# EAGLE design smarty02 (EAGLE 6.5.0)
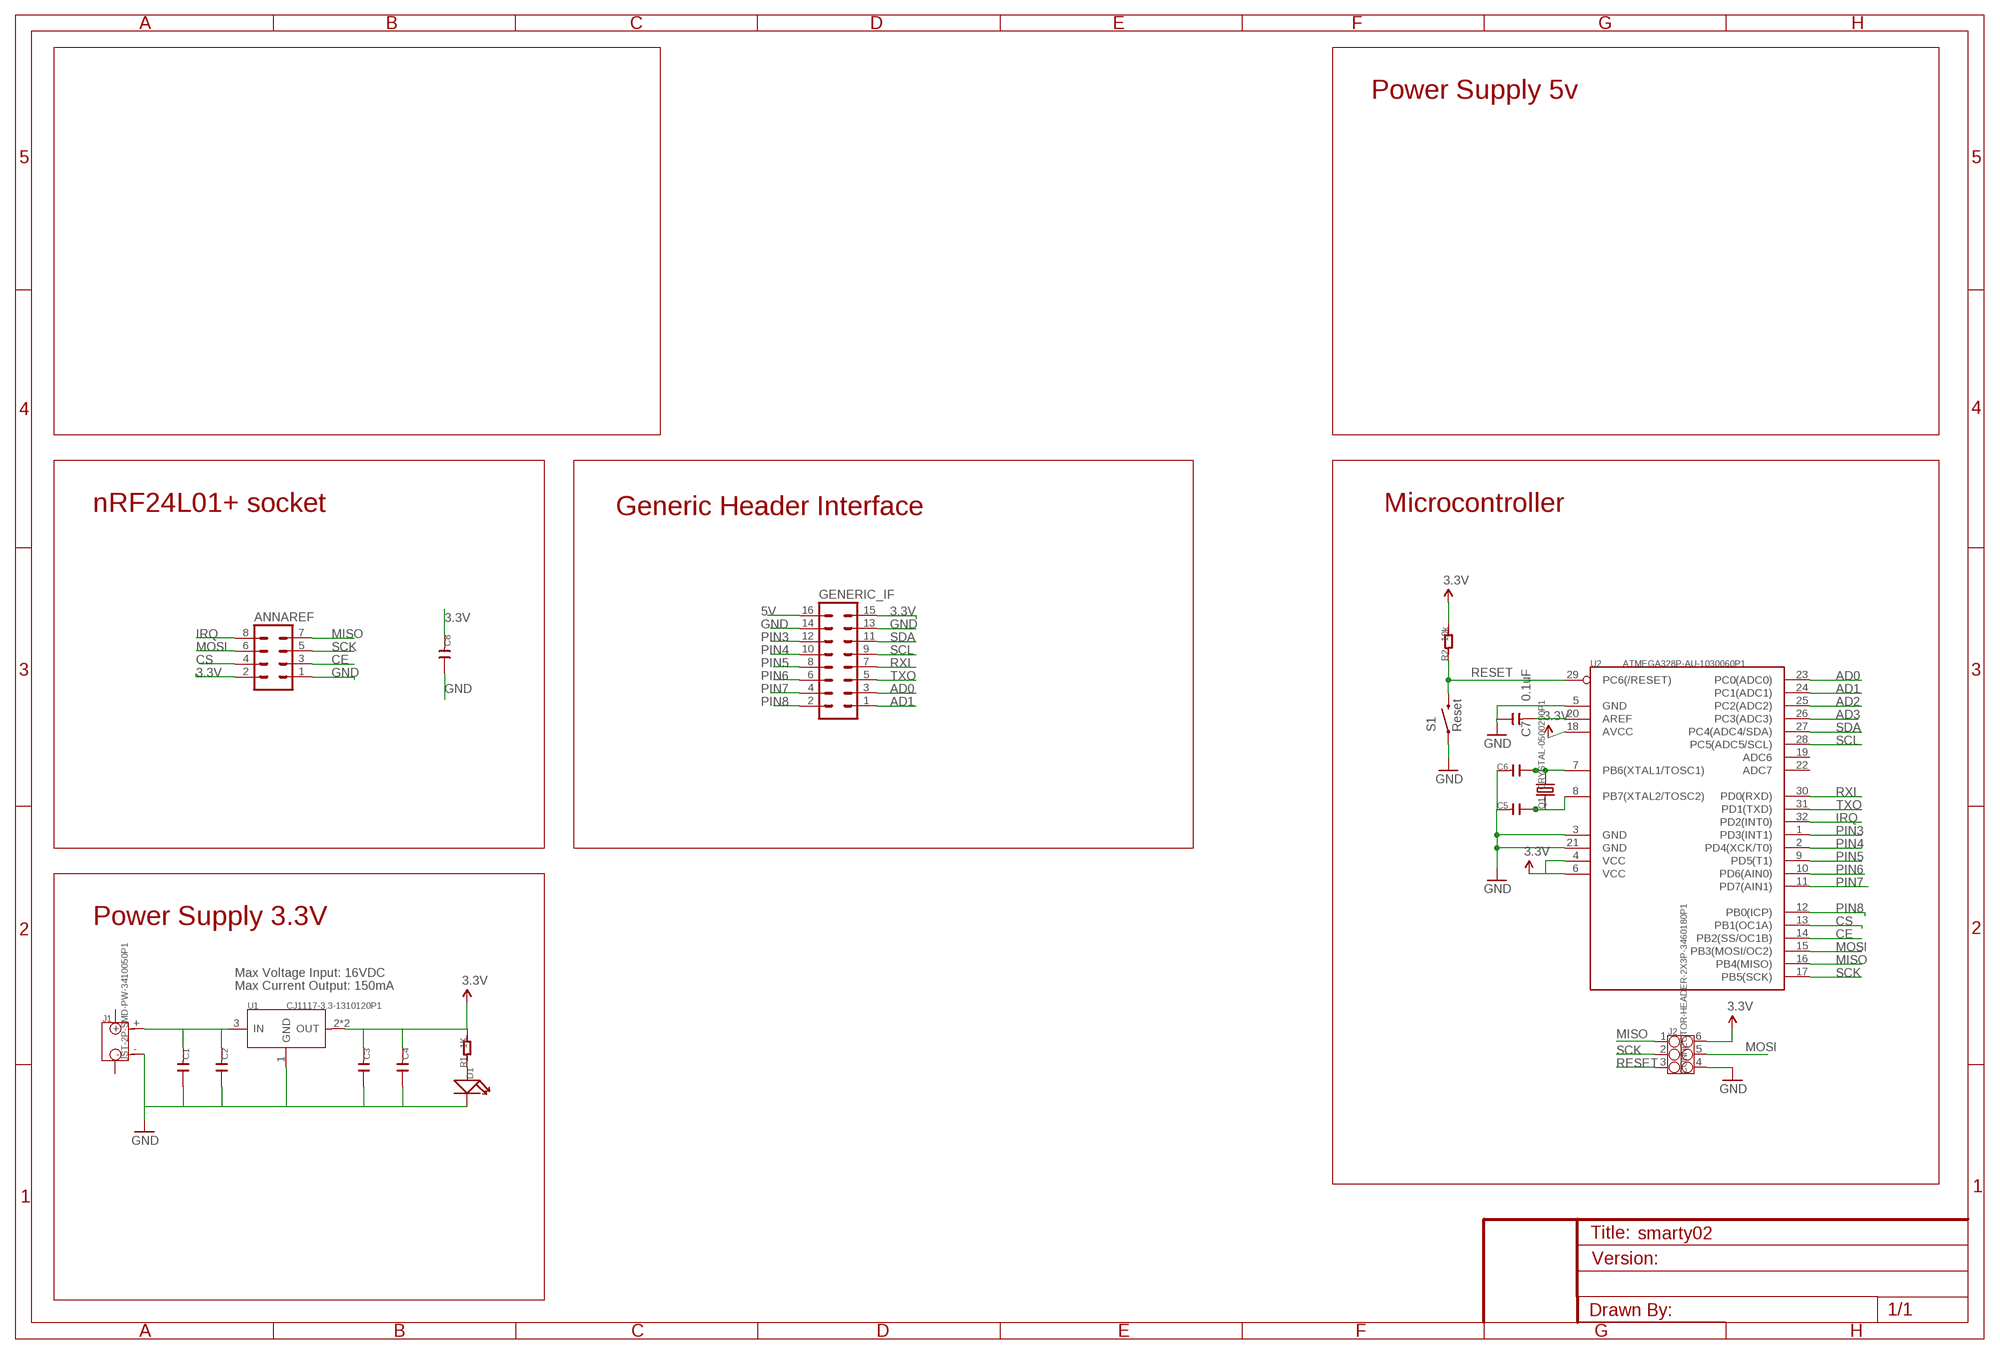
[diagram p0: schematic, sheet 1]

## Parts
ANNAREF  MA04-2  [MA04-2]
C1  C-0603  [C0603]
C2  C-0805  [C0805]
C3  C-0603  [C0603]
C4  C-0805  [C0805]
C5  C-0603  [C0603]
C6  C-0603  [C0603]
C7  0.1uF  C-0805  [C0805]
C8  C-0805  [C0805]
D1  LED  [LED0603]
GENERIC_IF  MA08-2  [MA08-2]
J1  JST-2P-SMD-PW-3410050P1  [2P-SMD-2.0-90D]
J2  CONNECTOR-HEADER-2X3P-3460180P1  [2X3P-2.54-2.54-11.6-3.0-BLACK-MALE]
Q1  CRYSTAL-0500290P1  [2P-SMD-5.0X3.2]
R1  1K  R-0603  [R0603]
R2  10k  R-0603  [R0603]
S1  Reset  SWITCH-MOMENTARY-2SMD  [TACTILE_SWITCH_SMD]
U1  CJ1117-3.3-1310120P1  [SOT89]
U2  ATMEGA328P-AU-1030060P1  [TQFP32]

## Nets
3.3V [power]: ANNAREF.2 C3.1 C4.1 C8.1 GENERIC_IF.15 J2.6 R1.2 R2.2 U1.2(OUT) U1.4(OUT) U2.4(VCC) U2.6(VCC) U2.18(AVCC)
5V: GENERIC_IF.16
AD0: GENERIC_IF.3 U2.23(PC0(ADC0))
AD1: GENERIC_IF.1 U2.24(PC1(ADC1))
AD2: U2.25(PC2(ADC2))
AD3: U2.26(PC3(ADC3))
CE: ANNAREF.3 U2.14(PB2(SS/OC1B))
CS: ANNAREF.4 U2.13(PB1(OC1A))
GND [power]: ANNAREF.1 C1.2 C2.2 C3.2 C4.2 C5.1 C6.1 C7.2 C8.2 D1.- GENERIC_IF.13 GENERIC_IF.14 J1.- J2.4 S1.1 U1.1(GND) U2.3(GND) U2.5(GND) U2.21(GND)
IRQ: ANNAREF.8 U2.32(PD2(INT0))
MISO: ANNAREF.7 J2.1 U2.16(PB4(MISO))
MOSI: ANNAREF.6 J2.5 U2.15(PB3(MOSI/OC2))
N$1: C7.1 U2.20(AREF)
N$2: C6.2 Q1.2 U2.7(PB6(XTAL1/TOSC1))
N$4: C5.2 Q1.1 U2.8(PB7(XTAL2/TOSC2))
N$5: D1.+ R1.1
N$6 [power]: C1.1 C2.1 J1.+ U1.3(IN)
PIN3: GENERIC_IF.12 U2.1(PD3(INT1))
PIN4: GENERIC_IF.10 U2.2(PD4(XCK/T0))
PIN5: GENERIC_IF.8 U2.9(PD5(T1))
PIN6: GENERIC_IF.6 U2.10(PD6(AIN0))
PIN7: GENERIC_IF.4 U2.11(PD7(AIN1))
PIN8: GENERIC_IF.2 U2.12(PB0(ICP))
RESET: J2.3 R2.1 S1.3 U2.29(PC6(/RESET))
RXI: GENERIC_IF.7 U2.30(PD0(RXD))
SCK: ANNAREF.5 J2.2 U2.17(PB5(SCK))
SCL: GENERIC_IF.9 U2.28(PC5(ADC5/SCL))
SDA: GENERIC_IF.11 U2.27(PC4(ADC4/SDA))
TXO: GENERIC_IF.5 U2.31(PD1(TXD))
Unconnected: J1.3 J1.4 U2.19(ADC6) U2.22(ADC7)

## Notes on the sheet
- Power Supply 5v
- nRF24L01+ socket | Generic Header Interface | Microcontroller
- Power Supply 3.3V
- Max Voltage Input: 16VDC
- Max Current Output: 150mA

## Library data of the parts
ANNAREF = con-lstb:MA04-2: PIN HEADER; OC_FARNELL: unknown; OC_NEWARK: unknown
C1-C8 = OPL:C*
D1 = OPL:LED*: LED
GENERIC_IF = con-lstb:MA08-2: PIN HEADER; OC_FARNELL: unknown; OC_NEWARK: unknown
J1 = OPL:JST-2P-SMD-PW
J2 = OPL:CONNECTOR-HEADER-2X3P
Q1 = OPL:CRYSTAL*
R1 R2 = OPL:R*
S1 = SparkFun:SWITCH-MOMENTARY-2
U1 = OPL:CJ1117-3.3: 1A Low Dropout Linear Regulator
U2 = OPL:ATMEGA328P-AU: 8-bit AVR Microcontroller with 32K Bytes In-System Programmable Flash

## Net classes
0 default: width 0.203 mm, drill 0.203 mm, clearance 0.305 mm
1 power: width 0.254 mm, drill 0.406 mm, clearance 0.305 mm

## Board
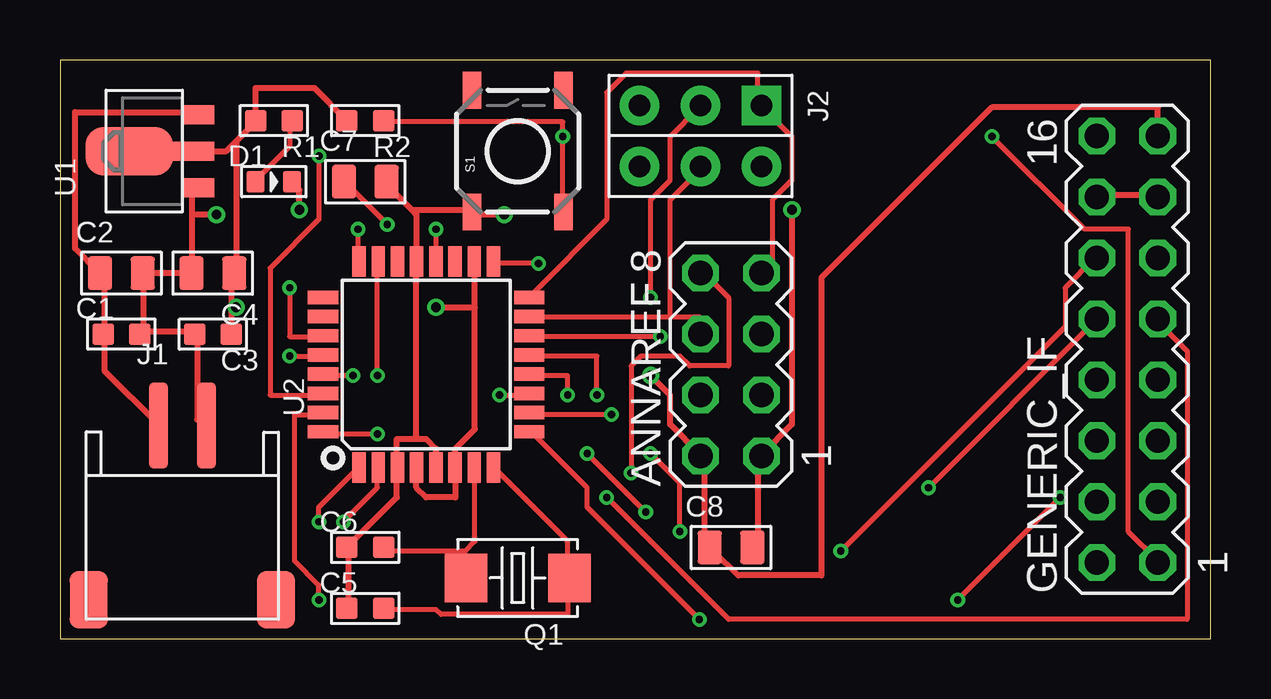
[diagram p1: board, top side]
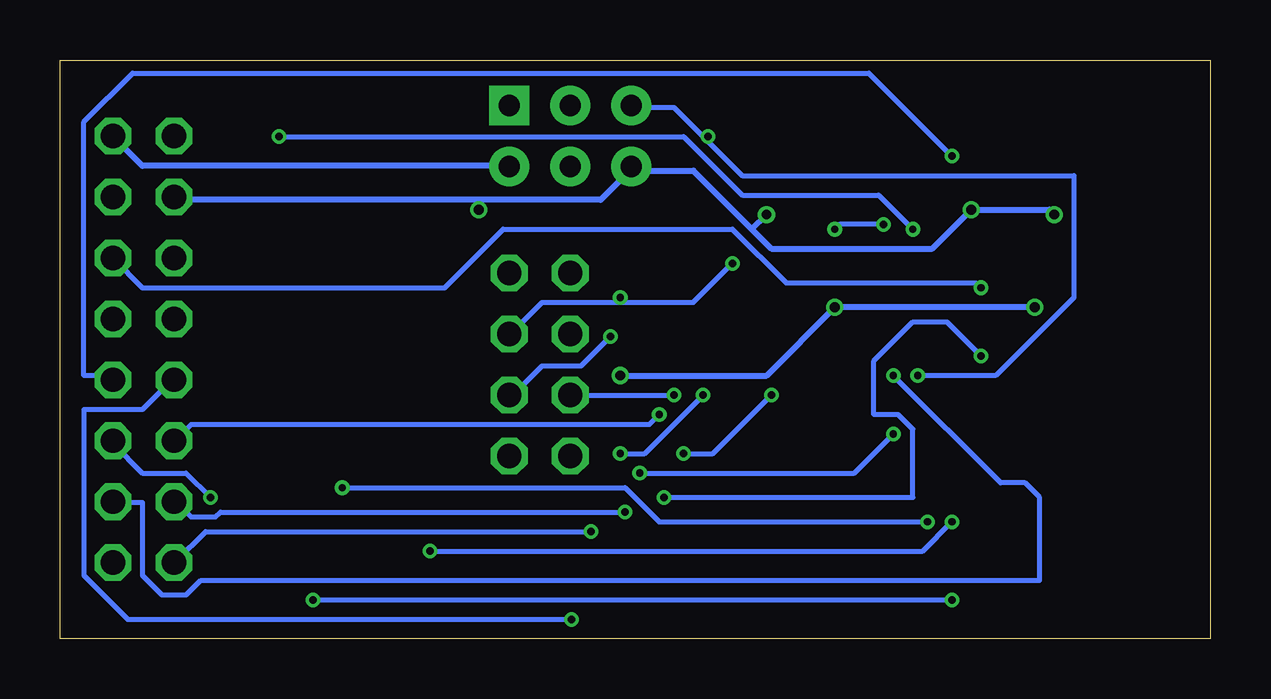
[diagram p2: board, bottom side, seen from below]

Size 47.93 x 24.12 mm. Coordinates in mm from the lower left corner, seen from the top.
Outline: 0,0 47.93,0 47.93,24.12 0,24.12 0,0
Copper layers (1*2*15*16): Top 0.035mm / dielectric 0.2mm / layer 2 0.0175mm / dielectric 1.1mm / layer 15 0.0175mm / dielectric 0.2mm / Bottom 0.035mm
Design rules "SeeedStudio_DRU_no_angle_20130527": minimum track width 6mil, minimum drill 12mil, track to track 6mil, track to pad 6mil, pad to pad 6mil, via to via 6mil, smd to smd 0mil, copper to edge 10mil, drill to drill 10mil, minimum pad ring 6mil, minimum via ring 6mil, stop-mask expansion 2mil, vias tented up to drill 25mil, thermal gap 10mil

### Footprints (pad centres in the part's own frame; a part is rotated, then mirrored left to right if it is on the bottom)
MA04-2 = drill 1.016 octagon: 1 -3.81,-1.27; 2 -3.81,1.27; 3 -1.27,-1.27; 4 -1.27,1.27; 5 1.27,-1.27; 6 1.27,1.27; 7 3.81,-1.27; 8 3.81,1.27
C0603 = smd 0.889 x 0.889: 1 -0.762,0; 2 0.762,0
C0805 = smd 1.016 x 1.397: 1 -0.889,0; 2 0.889,0
LED0603 = smd 0.762 x 0.889: + -0.762,0; - 0.762,0
MA08-2 = drill 1.016 octagon: 1 -8.89,-1.27; 2 -8.89,1.27; 3 -6.35,-1.27; 4 -6.35,1.27; 5 -3.81,-1.27; 6 -3.81,1.27; 7 -1.27,-1.27; 8 -1.27,1.27; 9 1.27,-1.27; 10 1.27,1.27; 11 3.81,-1.27; 12 3.81,1.27; 13 6.35,-1.27; 14 6.35,1.27; 15 8.89,-1.27; 16 8.89,1.27
2P-SMD-2.0-90D = smd 1.6 x 2.4: 3 3.9,-2.181; 4 -3.9,-2.181 | smd 0.8 x 3.6: + -1,5.08; - 1,5.08
2X3P-2.54-2.54-11.6-3.0-BLACK-MALE = drill 0.889 pad 1.651 square: 1 -1.27,2.54 | drill 0.889 pad 1.651: 2 -1.27,0; 3 -1.27,-2.54; 4 1.27,-2.54; 5 1.27,0; 6 1.27,2.54
2P-SMD-5.0X3.2 = smd 1.778 x 2.032: 1 -2.159,0; 2 2.159,0
R0603 = smd 0.889 x 0.889: 1 -0.762,0; 2 0.762,0
TACTILE_SWITCH_SMD = smd 1.524 x 0.762: 1 -2.54,1.905; 2 2.54,1.905; 3 -2.54,-1.905; 4 2.54,-1.905
SOT89 = smd 0.8 x 1.4: 1 -1.524,-1.905; 3 1.524,-1.905 | smd 0.8 x 1.9: 2 0,-1.651 | smd 2.032 x 3.65: 4 0,0.94
TQFP32 = smd 1.27 x 0.559: 1 -4.293,2.8; 2 -4.293,2; 3 -4.293,1.2; 4 -4.293,0.4; 5 -4.293,-0.4; 6 -4.293,-1.2; 7 -4.293,-2; 8 -4.293,-2.8; 17 4.293,-2.8; 18 4.293,-2; 19 4.293,-1.2; 20 4.293,-0.4; 21 4.293,0.4; 22 4.293,1.2; 23 4.293,2; 24 4.293,2.8 | smd 0.559 x 1.27: 9 -2.8,-4.293; 10 -2,-4.293; 11 -1.2,-4.293; 12 -0.4,-4.293; 13 0.4,-4.293; 14 1.2,-4.293; 15 2,-4.293; 16 2.8,-4.293; 25 2.8,4.293; 26 2,4.293; 27 1.2,4.293; 28 0.4,4.293; 29 -0.4,4.293; 30 -1.2,4.293; 31 -2,4.293; 32 -2.8,4.293

### Placement (x,y rotation side)
ANNAREF  27.94,11.43 90 top
C1  2.54,12.7 0 top
C2  2.54,15.24 0 top
C3  6.35,12.7 180 top
C4  6.35,15.24 180 top
C5  12.7,1.27 0 top
C6  12.7,3.81 0 top
C7  12.7,19.05 0 top
C8  27.94,3.81 0 top
D1  8.89,19.05 0 top
GENERIC_IF  44.45,12.06 90 top
J1  5.08,3.81 0 top
J2  26.67,20.95 270 top
Q1  19.05,2.54 180 top
R1  8.89,21.59 180 top
R2  12.7,21.59 180 top
S1  19.05,20.32 90 top
U1  3.81,20.32 90 top
U2  15.24,11.43 90 top

### Tracks (layer width: path | path; a pad name or v marks a point on that pad's centre or on a via)
3.3V  (via drill 0.41)
  Top 0.254: U2.4 14.83,7.11 14.83,6.3 15.24,5.89 16.46,5.89 16.46,7.11 U2.6 16.46,7.32 16.46,7.92 17.27,8.74 17.27,13.82 | 17.27,13.82 17.27,15.65 U2.18 | 7.11,13.82 7.11,15.24 C4.1 7.32,15.24 7.32,20.73 | 7.11,13.82 C3.1 | 7.32,20.73 6.91,20.32 U1.2 U1.4 | 7.32,20.73 8.13,21.54 R1.2 8.13,22.96 10.57,22.96 R2.2 | v15.65,13.82 17.27,13.82 | 7.11,13.82 v7.32,13.82 | GENERIC_IF.15 45.72,22.15 38.81,22.15 31.7,15.04 31.7,2.64 28.25,2.64 27.23,3.66 C8.1 27.03,3.86 26.82,4.06 26.82,7.52 ANNAREF.2 26.62,7.72 25.4,8.94 25.4,10.16 v24.59,10.97
  Bottom 0.254: v7.32,13.82 v15.65,13.82 18.49,10.97 v24.59,10.97 | GENERIC_IF.15 45.72,20.93 44.5,19.71 29.26,19.71 J2.6
AD0  (via drill 0.3)
  Top 0.203: v13.21,10.97 13.21,15.65 U2.23
  Bottom 0.203: v13.21,10.97 8.74,6.5 7.72,6.5 7.11,5.89 7.11,2.44 42.06,2.44 42.67,1.83 43.69,1.83 44.5,2.64 44.5,5.69 45.72,5.69 GENERIC_IF.3
AD1  (via drill 0.3)
  Top 0.203: v12.39,17.07 12.39,15.85 U2.24 | v38.81,20.93 42.67,17.07 44.5,17.07 44.5,4.47 45.72,3.25 GENERIC_IF.1
  Bottom 0.203: v12.39,17.07 13.82,18.49 19.51,18.49 21.95,20.93 v38.81,20.93
CE  (via drill 0.3)
  Top 0.203: v24.99,12.6 19.71,12.6 U2.14
  Bottom 0.203: v24.99,12.6 26.21,11.38 27.84,11.38 29.06,10.16 ANNAREF.3
CS  (via drill 0.3)
  Top 0.203: v22.35,10.16 22.35,11.79 19.71,11.79 U2.13
  Bottom 0.203: ANNAREF.4 v22.35,10.16
GND  (via drill 0.41)
  Top 0.254: 14.63,17.88 13.61,18.9 C7.2 | 14.63,17.88 14.83,17.68 14.83,15.85 U2.21 14.83,15.65 14.83,8.33 | 14.63,17.88 17.07,17.88 S1.1 17.27,17.68 v18.49,17.68 | C5.1 11.99,1.42 11.99,3.66 C6.1 14.02,5.89 14.02,7.11 U2.3 14.02,7.32 14.02,8.33 14.83,8.33 | 14.83,8.33 15.24,8.33 15.65,7.92 15.65,7.32 U2.5 | 3.45,12.8 5.49,12.8 C3.2 5.69,12.6 5.69,9.14 5.89,8.94 J1.- | 3.45,15.24 C4.2 5.49,15.24 5.49,17.68 | 5.49,17.68 5.49,18.49 5.69,18.69 U1.1 | 3.45,15.24 3.45,12.8 | 3.45,12.8 C1.2 | 3.45,15.24 C2.2 | C8.2 28.85,3.86 29.06,4.06 29.06,7.52 ANNAREF.1 29.26,7.72 30.48,8.94 v30.48,17.88 | GENERIC_IF.14 43.28,18.49 45.72,18.49 GENERIC_IF.13 | v9.96,17.88 9.96,18.69 9.75,18.9 D1.- | v6.5,17.68 5.49,17.68
  Bottom 0.254: 19.1,17.07 21.54,19.51 23.98,19.51 J2.4 24.18,19.51 25.4,18.29 30.48,18.29 | 19.1,17.07 18.29,16.26 11.58,16.26 v9.96,17.88 6.71,17.88 v6.5,17.68 | 30.48,18.29 43.08,18.29 GENERIC_IF.14 | 30.48,18.29 v30.48,17.88 | 19.1,17.07 v18.49,17.68
IRQ  (via drill 0.3)
  Top 0.203: v13.21,8.53 10.97,8.53 U2.32 | v23.77,6.91 23.77,11.38 24.18,11.79 25.81,11.79 26.21,11.38 27.84,11.38 27.84,14.22 26.82,15.24 ANNAREF.8
  Bottom 0.203: v13.21,8.53 14.83,6.91 v23.77,6.91
MISO
  Top 0.203: U2.16 19.71,14.43 22.76,17.48 22.76,22.76 23.57,23.57 29.06,23.57 29.06,22.35 J2.1 29.26,22.15 30.48,20.93 30.48,19.1 29.67,18.29 29.67,15.65 29.26,15.24 ANNAREF.7
MOSI
  Top 0.203: 25.4,13.41 26.62,13.41 26.62,12.8 ANNAREF.6 | 25.4,13.41 19.71,13.41 U2.15 | 25.4,13.41 25.4,18.29 26.62,19.51 J2.5
N$1  (via drill 0.3)
  Top 0.203: v15.65,17.07 15.65,15.85 U2.20 | v13.61,17.27 11.99,18.9 C7.1
  Bottom 0.203: v15.65,17.07 15.44,17.27 v13.61,17.27
N$2
  Top 0.203: 13.61,3.86 C6.2 13.61,3.66 16.87,3.66 | 16.87,3.66 16.87,2.64 Q1.2 | 16.87,3.66 17.27,4.06 17.27,7.11 U2.7
N$4
  Top 0.203: 13.61,1.42 C5.2 13.61,1.22 15.65,1.22 15.85,1.02 21.13,1.02 21.13,2.44 Q1.1 21.13,2.64 21.13,4.06 18.09,7.11 U2.8
N$5
  Top 0.203: D1.+ 8.13,19.1 9.55,20.52 9.55,21.54 R1.1
N$6
  Top 0.254: U1.3 5.69,21.95 0.61,21.95 0.61,16.26 1.63,15.24 C2.1 1.83,15.24 1.83,12.8 C1.1 1.83,12.6 1.83,11.18 4.06,8.94 J1.+
PIN3  (via drill 0.3)
  Top 0.203: v10.77,4.88 10.77,5.49 12.39,7.11 U2.1 | v32.51,3.66 41.86,13.01 41.86,14.63 43.08,15.85 GENERIC_IF.12
  Bottom 0.203: v10.77,4.88 11.99,3.66 v32.51,3.66
PIN4  (via drill 0.3)
  Top 0.203: v11.79,4.88 13.21,6.3 13.21,7.11 U2.2 | v36.17,6.3 43.08,13.21 GENERIC_IF.10
  Bottom 0.203: v11.79,4.88 22.96,4.88 24.38,6.3 v36.17,6.3
PIN5  (via drill 0.3)
  Top 0.203: v26.62,0.81 21.95,5.49 21.95,6.3 19.71,8.53 U2.9
  Bottom 0.203: v26.62,0.81 45.11,0.81 46.94,2.64 46.94,9.55 44.5,9.55 43.28,10.77 GENERIC_IF.8
PIN6  (via drill 0.3)
  Top 0.203: v22.96,9.35 19.71,9.35 U2.10
  Bottom 0.203: v22.96,9.35 23.37,8.94 42.47,8.94 43.08,8.33 GENERIC_IF.6
PIN7  (via drill 0.3)
  Top 0.203: v18.29,10.16 19.51,10.16 U2.11 | v24.38,5.28 v21.95,7.72
  Bottom 0.203: v18.29,10.16 20.73,7.72 v21.95,7.72 | v24.38,5.28 41.25,5.28 41.45,5.08 42.47,5.08 43.08,5.69 GENERIC_IF.4
PIN8  (via drill 0.3)
  Top 0.203: v21.13,10.16 21.13,10.97 19.71,10.97 U2.12 | v24.59,7.72 25.81,6.5 v25.81,4.47
  Bottom 0.203: v21.13,10.16 23.57,7.72 v24.59,7.72 | v25.81,4.47 41.86,4.47 43.08,3.25 GENERIC_IF.2
RESET  (via drill 0.3)
  Top 0.203: R2.1 13.61,21.54 20.93,21.54 v20.93,20.93 20.93,17.88 S1.3 | v12.19,10.97 10.97,10.97 U2.29
  Bottom 0.203: v12.19,10.97 8.94,10.97 5.69,14.22 5.69,19.3 19.51,19.3 21.13,20.93 | 21.13,20.93 22.35,22.15 23.98,22.15 J2.3 | 21.13,20.93 v20.93,20.93
RXI  (via drill 0.3)
  Top 0.203: v10.77,20.12 10.77,17.48 8.74,15.44 8.74,10.16 10.77,10.16 U2.30
  Bottom 0.203: v10.77,20.12 14.22,23.57 44.91,23.57 46.94,21.54 46.94,10.97 45.72,10.97 GENERIC_IF.7
SCK  (via drill 0.3)
  Top 0.203: v19.91,15.65 18.09,15.65 U2.17 | v24.59,14.22 24.59,18.29 25.4,19.1 25.4,20.93 26.62,22.15 J2.2
  Bottom 0.203: v19.91,15.65 21.54,14.02 24.59,14.02 | 24.59,14.02 27.84,14.02 29.06,12.8 ANNAREF.5 | 24.59,14.02 v24.59,14.22
SCL  (via drill 0.3)
  Top 0.203: v9.55,11.79 10.77,11.79 U2.28 | v22.76,5.89 27.84,0.81 46.94,0.81 46.94,11.99 45.72,13.21 GENERIC_IF.9
  Bottom 0.203: v9.55,11.79 10.97,13.21 12.39,13.21 14.02,11.58 14.02,9.35 13.01,9.35 12.39,8.74 12.39,5.89 v22.76,5.89
SDA  (via drill 0.3)
  Top 0.203: v9.55,14.63 9.55,12.6 10.77,12.6 U2.27
  Bottom 0.203: v9.55,14.63 9.75,14.83 17.68,14.83 19.91,17.07 29.46,17.07 31.9,14.63 44.5,14.63 45.72,15.85 GENERIC_IF.11
TXO  (via drill 0.3)
  Top 0.203: v10.77,1.63 10.77,2.23 9.75,3.25 9.75,9.35 10.77,9.35 U2.31 | v41.66,5.89 v37.39,1.63
  Bottom 0.203: v37.39,1.63 v10.77,1.63 | v41.66,5.89 42.67,6.91 44.5,6.91 45.72,8.13 GENERIC_IF.5